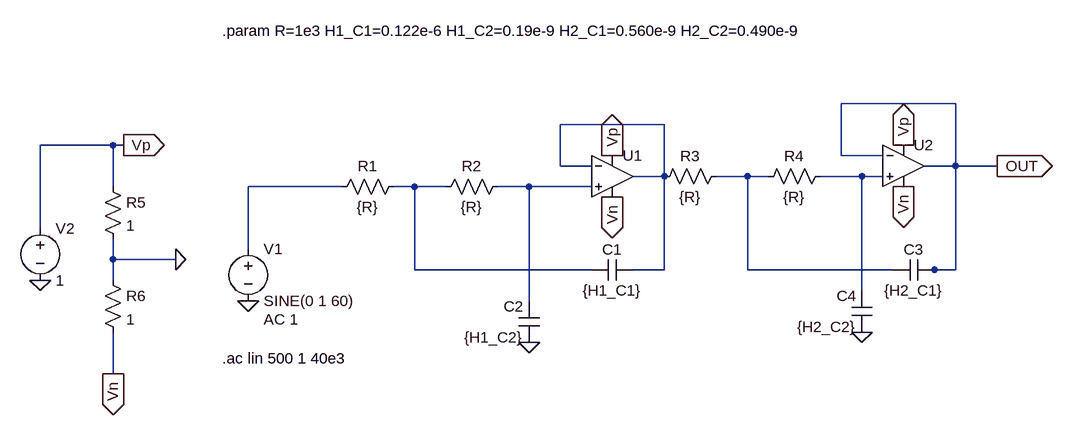
[diagram p0: schematic after_confirming_right_capacitors.asc]
after_confirming_right_capacitors.asc, the LTspice schematic file:
Version 4.1
SHEET 1 880 680
WIRE 608 64 432 64
WIRE 160 96 0 96
WIRE -688 128 -800 128
WIRE -672 128 -688 128
WIRE 432 144 432 64
WIRE 496 144 432 144
WIRE 0 160 0 96
WIRE 48 160 0 160
WIRE 608 160 608 64
WIRE 608 160 560 160
WIRE 672 160 608 160
WIRE 160 176 160 96
WIRE 160 176 112 176
WIRE 288 176 240 176
WIRE 320 176 288 176
WIRE 464 176 400 176
WIRE 496 176 464 176
WIRE -688 192 -688 128
WIRE -336 192 -480 192
WIRE -224 192 -256 192
WIRE -176 192 -224 192
WIRE -48 192 -96 192
WIRE 48 192 -48 192
WIRE -800 256 -800 128
WIRE -480 288 -480 192
WIRE -688 304 -688 272
WIRE -592 304 -688 304
WIRE -224 320 -224 192
WIRE 48 320 -224 320
WIRE 160 320 160 176
WIRE 160 320 112 320
WIRE 288 320 288 176
WIRE 512 320 288 320
WIRE 576 320 560 320
WIRE 608 320 608 160
WIRE 608 320 576 320
WIRE -688 336 -688 304
WIRE 464 352 464 176
WIRE -48 368 -48 192
WIRE -688 480 -688 416
FLAG -48 432 0
FLAG -480 368 0
FLAG 464 416 0
FLAG 672 160 OUT
IOPIN 672 160 Out
FLAG -688 480 Vn
IOPIN -688 480 Out
FLAG -672 128 Vp
IOPIN -672 128 Out
FLAG -592 304 0
FLAG 80 144 Vp
IOPIN 80 144 Out
FLAG 528 128 Vp
IOPIN 528 128 Out
FLAG 80 208 Vn
IOPIN 80 208 Out
FLAG 528 192 Vn
IOPIN 528 192 Out
FLAG -800 336 0
SYMBOL cap 112 304 R90
WINDOW 0 0 32 VBottom 2
WINDOW 3 32 32 VTop 2
SYMATTR InstName C1
SYMATTR Value {H1_C1}
SYMBOL cap -32 432 R180
WINDOW 0 24 56 Left 2
WINDOW 3 24 8 Left 2
SYMATTR InstName C2
SYMATTR Value {H1_C2}
SYMBOL res -240 176 R90
WINDOW 0 0 56 VBottom 2
WINDOW 3 32 56 VTop 2
SYMATTR InstName R1
SYMATTR Value {R}
SYMBOL res -80 176 R90
WINDOW 0 0 56 VBottom 2
WINDOW 3 32 56 VTop 2
SYMATTR InstName R2
SYMATTR Value {R}
SYMBOL voltage -480 272 R0
WINDOW 123 24 124 Left 2
WINDOW 39 0 0 Left 0
SYMATTR Value2 AC 1
SYMATTR InstName V1
SYMATTR Value SINE(0 1 60)
SYMBOL res 256 160 R90
WINDOW 0 0 56 VBottom 2
WINDOW 3 32 56 VTop 2
SYMATTR InstName R3
SYMATTR Value {R}
SYMBOL res 416 160 R90
WINDOW 0 0 56 VBottom 2
WINDOW 3 32 56 VTop 2
SYMATTR InstName R4
SYMATTR Value {R}
SYMBOL cap 512 336 R270
WINDOW 0 32 32 VTop 2
WINDOW 3 0 32 VBottom 2
SYMATTR InstName C3
SYMATTR Value {H2_C1}
SYMBOL cap 480 416 R180
WINDOW 0 24 56 Left 2
WINDOW 3 24 8 Left 2
SYMATTR InstName C4
SYMATTR Value {H2_C2}
SYMBOL OpAmps\\UniversalOpAmp2 80 176 R0
SYMATTR InstName U1
SYMBOL OpAmps\\UniversalOpAmp2 528 160 R0
SYMATTR InstName U2
SYMBOL voltage -800 240 R0
WINDOW 123 0 0 Left 0
WINDOW 39 0 0 Left 0
SYMATTR InstName V2
SYMATTR Value 1
SYMBOL res -704 176 R0
SYMATTR InstName R5
SYMATTR Value 1
SYMBOL res -704 320 R0
SYMATTR InstName R6
SYMATTR Value 1
TEXT -520 -48 Left 2 !.param R=1e3 H1_C1=0.122e-6 H1_C2=0.19e-9 H2_C1=0.560e-9 H2_C2=0.490e-9
TEXT -520 456 Left 2 !.ac lin 500 1 40e3

The netlist it stands for:
* after_confirming_right_capacitors.asc
C1 N001 N005 {H1_C1}
C2 0 N006 {H1_C2}
R1 N005 N004 {R}
R2 N006 N005 {R}
V1 N004 0 SINE(0 1 60) AC 1
R3 N002 N001 {R}
R4 N003 N002 {R}
C3 N002 OUT {H2_C1}
C4 0 N003 {H2_C2}
X§U1 N006 N001 Vp Vn N001 level2 Avol=1Meg GBW=10Meg Slew=10Meg Ilimit=25m Rail=0 Vos=0 En=0 Enk=0 In=0 Ink=0 Rin=500Meg  ; pins In+ In- V+ V- OUT
X§U2 N003 OUT Vp Vn OUT level2 Avol=1Meg GBW=10Meg Slew=10Meg Ilimit=25m Rail=0 Vos=0 En=0 Enk=0 In=0 Ink=0 Rin=500Meg  ; pins In+ In- V+ V- OUT
V2 Vp 0 1
R5 Vp 0 1
R6 0 Vn 1
.param R=1e3 H1_C1=0.122e-6 H1_C2=0.19e-9 H2_C1=0.560e-9 H2_C2=0.490e-9
.ac lin 500 1 40e3
.lib UniversalOpAmp2.lib
.backanno
.end